# EAGLE design pwrfet (EAGLE 4.13)

## Sheet 1 of 2
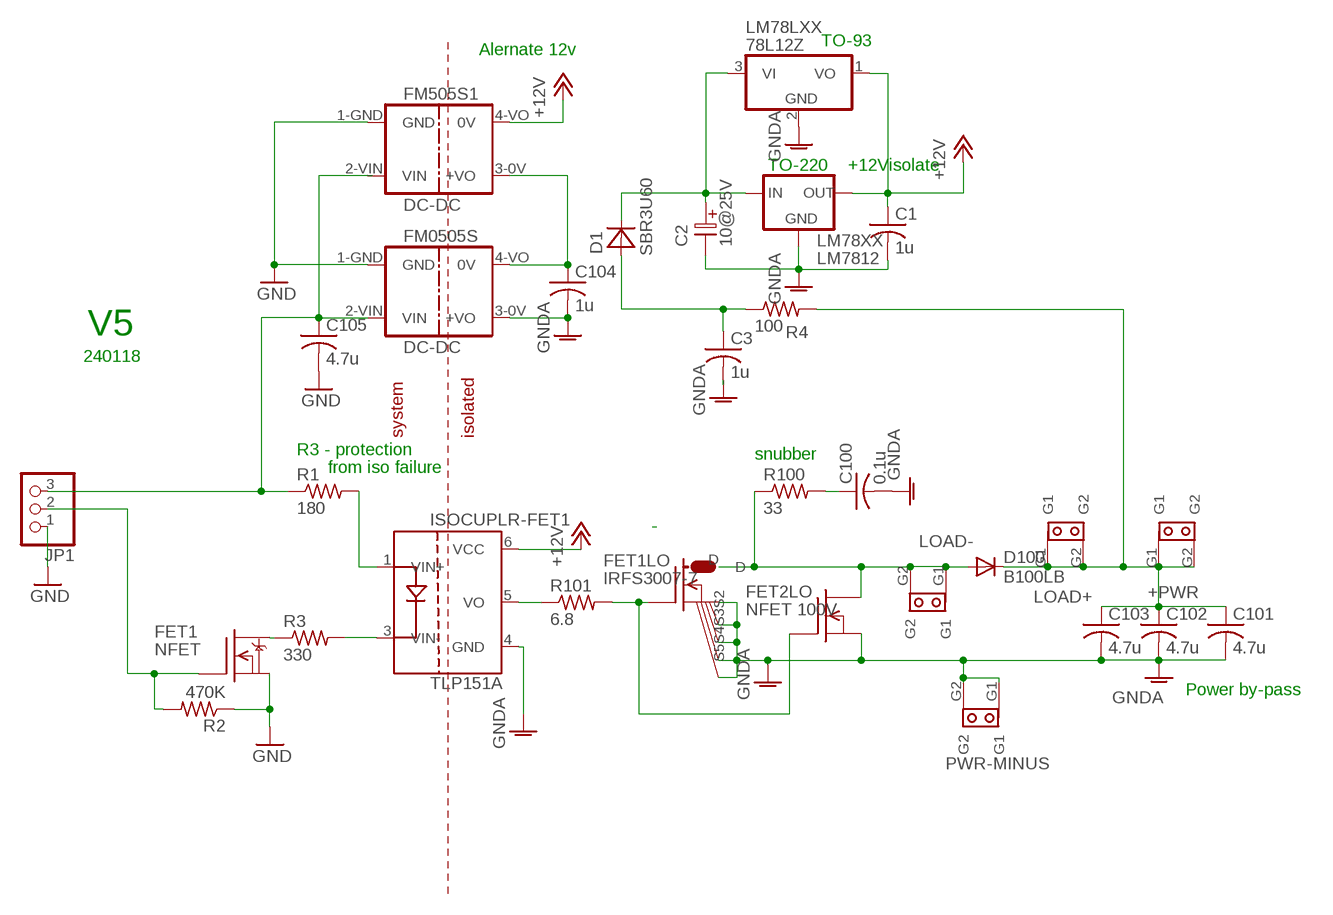
[diagram p0: schematic, sheet 1]

### Parts
+PWR  SPADE-TAB  [SPADE_TAB]
C1  1u  C-USC0603  [C0603]
C2  10@25V  ELC-2,5L  [ES-2,5L]
C3  1u  C-USC0603  [C0603]
C100  0.1u  C-USC0603  [C0603]
C101  4.7u  C-USC0805  [C0805]
C102  4.7u  C-USC0805  [C0805]
C103  4.7u  C-USC0805  [C0805]
C104  1u  C-USC0603  [C0603]
C105  4.7u  C-USC0805  [C0805]
D1  SBR3U60  [POWERDI123]
D100  B100LB  [SMB_1]
FET1  NFET  DMN3404L  [SOT-23]
FET1LO  IRFS3007-7  [D2PAK-7]
FET2LO  NFET 100V  RFP30N06  [TO220V]
FM0505S  DC-DC  [DC-DC]
FM505S1  DC-DC  [DC-DC]
ISOCUPLR-FET1  TLP151A  [SOT23-5X]
JP1  PINHD-1X3  [1X03]
LM78LXX  78L12Z  [TO92]
LM78XX  LM7812  78XXS  [78XXS]
LOAD+  SPADE-TAB  [SPADE_TAB]
LOAD-  SPADE-TAB  [SPADE_TAB]
PWR-MINUS  SPADE-TAB  [SPADE_TAB]
R1  180  R-US_R0603  [R0603]
R2  470K  R-US_R0603  [R0603]
R3  330  R-US_R0603  [R0603]
R4  100  R-US_R0603  [R0603]
R100  33  R-US_R0603  [R0603]
R101  6.8  R-US_R0603  [R0603]

### Nets
+5V: C105.1 FM505S1.2-VIN(VIN) FM0505S.2-VIN(VIN) JP1.3 R1.1
+12V: C1.1 FM505S1.4-VO(0V) ISOCUPLR-FET1.6(VCC) LM78LXX.1(VO) LM78XX.OUT
+PWR: +PWR.G1 +PWR.G2 C101.1 C102.1 C103.1 D100.C LOAD+.G1 LOAD+.G2 R4.2
DRAINFET1: D100.A FET1LO.D FET2LO.2(D) LOAD-.G1 LOAD-.G2 R100.1
GATE-FET1: FET1LO.G FET2LO.1(G) R101.2
GND: C105.2 FET1.2(S) FM505S1.1-GND(GND) FM0505S.1-GND(GND) JP1.1 R2.1
GNDA: C1.2 C2.2 C3.2 C100.2 C101.2 C102.2 C103.2 C104.2 FET1LO.S2(S1) FET1LO.S3(S2) FET1LO.S5(S3) FET1LO.S6(S4) FET1LO.S7(S5) FET2LO.3(S) FM0505S.3-0V(+VO) ISOCUPLR-FET1.4(GND) LM78LXX.2(GND) LM78XX.GND PWR-MINUS.G1 PWR-MINUS.G2
ISO5V: C104.1 FM505S1.3-0V(+VO) FM0505S.4-VO(0V)
ISO-ANODE: ISOCUPLR-FET1.1(VIN+) R1.2
ISO-CATH: ISOCUPLR-FET1.3(VIN-) R3.2
ISO-IN-DRAIN-FET1: FET1.3(D) R3.1
LO: ISOCUPLR-FET1.5(VO) R101.1
ONOFF-FET1: FET1.1(G) JP1.2 R2.2
PEAKPWR: C2.1 D1.C LM78LXX.3(VI) LM78XX.IN
PWR-RC: C3.1 D1.A R4.1
SNUB-RC: C100.1 R100.2

### Notes on the sheet
- TO-93
- Alernate 12v
- TO-220 | +12Visolate
- V5
- 240118
- system | isolated
- R3 - protection | snubber
- from iso failure
- Power by-pass

## Sheet 2 of 2

## Library data of the parts
+PWR LOAD+ LOAD- PWR-MINUS = DEH:SPADE-TAB
C1 C3 C100-C105 = rcl:C-US: CAPACITOR, American symbol
C2 = DEH:ELC-2,5L
D1 = diode-1:SBR3U60
D100 = diode-1:B100LB
FET1 = transistor-fet:DMN3404L
FET1LO = transistor-fet:IRFS3007-7
FET2LO = transistor-fet:RFP30N06
FM0505S FM505S1 = DEH:DC-DC
ISOCUPLR-FET1 = texas:TLP151A
JP1 = pinhead:PINHD-1X3: PIN HEADER
LM78LXX = linear:78*: Positive VOLTAGE REGULATOR
LM78XX = v-reg:78XXS: VOLTAGE REGULATOR
R1-R4 R100 R101 = rcl:R-US_: RESISTOR, American symbol

## Board
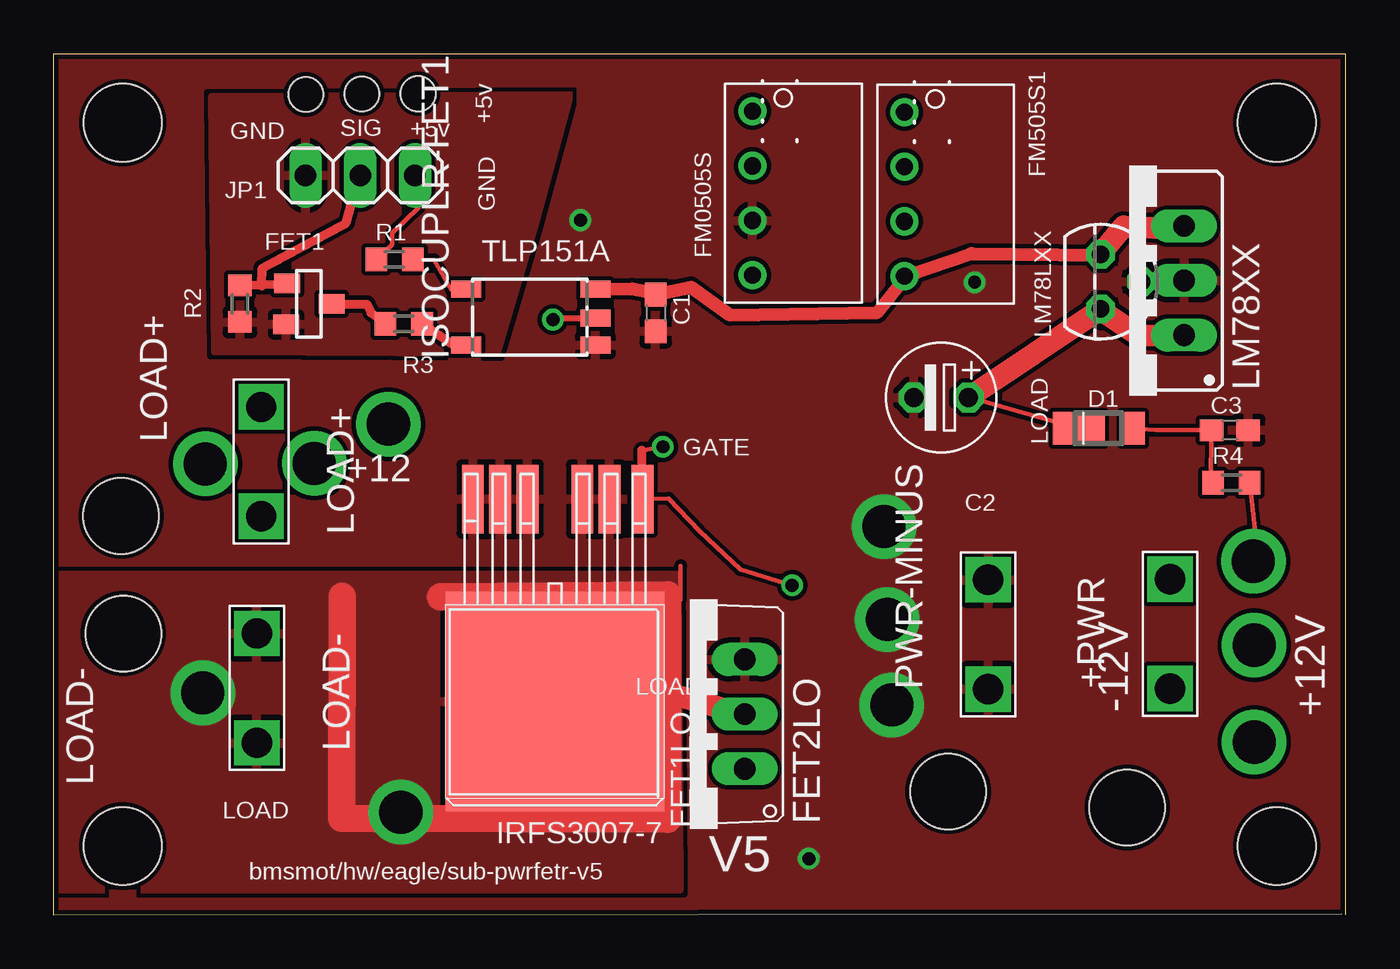
[diagram p1: board, top side]
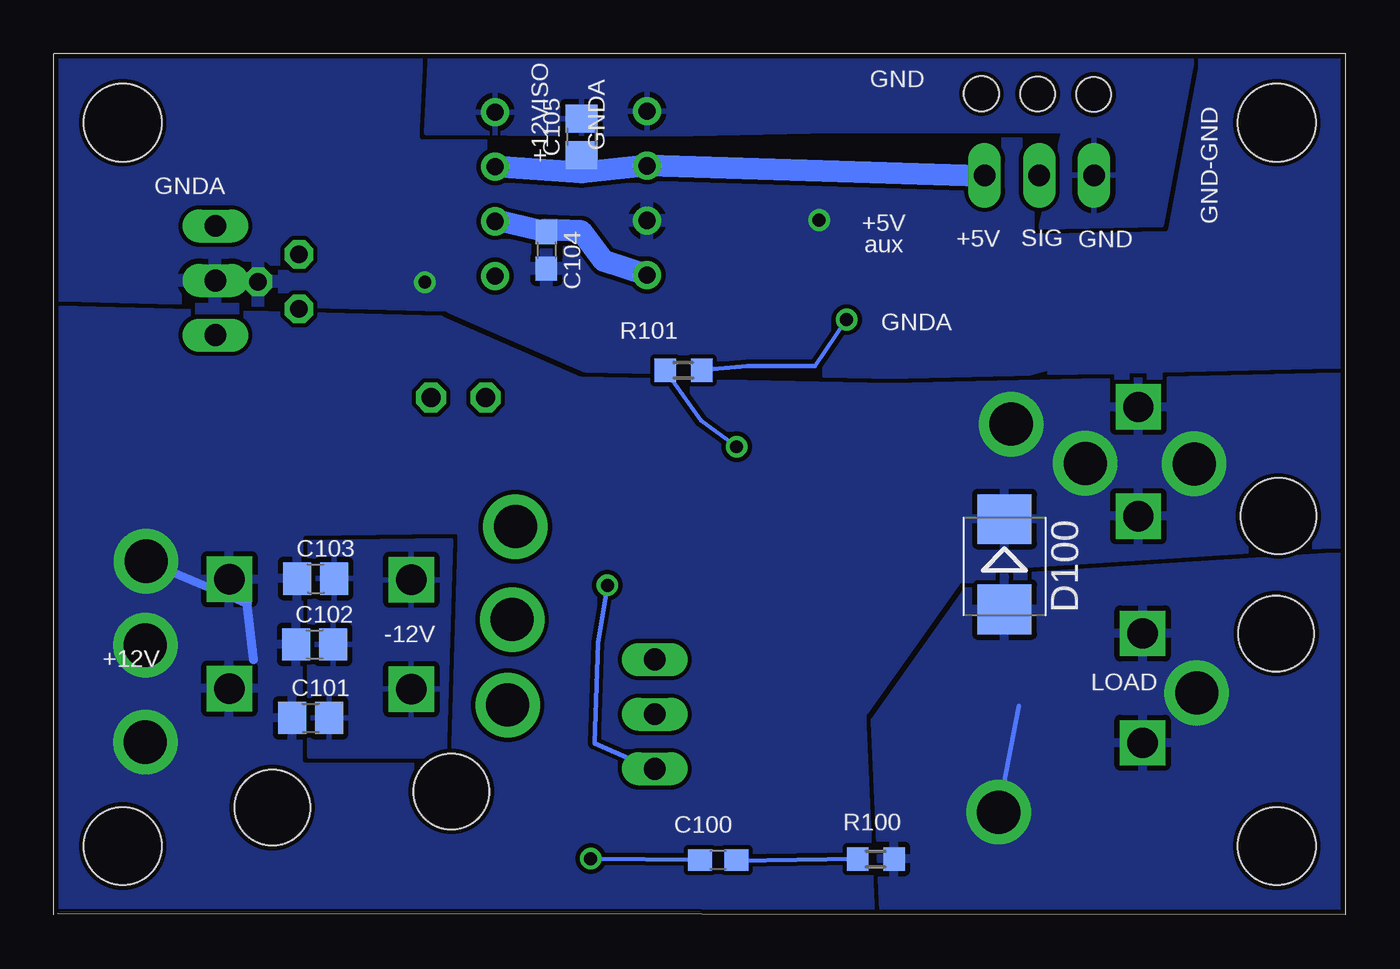
[diagram p2: board, bottom side, seen from below]

Size 60 x 40 mm. Coordinates in mm from the lower left corner, seen from the top.
Outline: 59.81,0.05 0,0 0,40 60,40 60,0
Copper layers (1*16): Top 0.035mm / dielectric 1.5mm / Bottom 0.035mm
Design rules "default": minimum track width 0.2mm, minimum drill 0.6mm, track to track 0.2mm, track to pad 0.2mm, pad to pad 0.2mm, via to via 8mil, smd to smd 0.2mm, copper to edge 9mil, drill to drill 8mil, minimum pad ring 10mil, minimum via ring 8mil, stop-mask expansion 4mil, vias tented up to drill 0mil, thermal gap 10mil
Holes 3.6 mm at 3.2,3.2 3.2,36.8 56.8,36.8 56.8,3.2
Holes 3.5 mm at 49.86,4.98 3.12,18.53 3.23,13.07 41.54,5.74
Holes 1.6 mm at 11.71,38.11 14.31,38.14 16.92,38.15

### Footprints (pad centres in the part's own frame; a part is rotated, then mirrored left to right if it is on the bottom)
SPADE_TAB = drill 1.4 square: G1 -2.54,0; G2 2.54,0
C0603 = smd 1.1 x 1: 1 -0.85,0; 2 0.85,0
ES-2,5L = drill 0.889 pad 1.27 octagon: 1 0,0; 2 2.54,0
C0805 = smd 1.3 x 1.5: 1 -0.85,0; 2 0.85,0
POWERDI123 = smd 1.1 x 1.5: A 1,0 | smd 2.4 x 1.5: C -1.5,0
SMB_1 = smd 2.3 x 2.5: A 1.9,0; C -2.3,0
SOT-23 = smd 0.9 x 1.2: 1 -1,-1.006; 2 0.9,-1.056; 3 -0.05,1.056
D2PAK-7 = smd 10.16 x 10.16: D 0,4.572 | smd 1.016 x 3.175: G -4.064,-4.826; S2 -2.54,-4.826; S3 -1.27,-4.826; S5 1.27,-4.826; S6 2.54,-4.826; S7 3.81,-4.826
TO220V = drill 1.016 long: 1 -2.54,-2.54; 2 0,-2.54; 3 2.54,-2.54
DC-DC = drill 0.8 round: 1-GND 0,-1.27; 2-VIN 2.54,-1.27; 3-0V 5.08,-1.27; 4-VO 7.62,-1.27
SOT23-5X = smd 0.8 x 1.4: 1 1.35,2.97; 3 -1.25,2.97; 4 -1.25,-3.03; 5 0,-3.03; 6 1.35,-3.03
1X03 = drill 1 long: 1 -2.54,0; 2 0,0; 3 2.54,0
TO92 = drill 0.813 octagon: 1 -1.27,0; 2 0,1.905; 3 1.27,0
78XXS = drill 1.016 long: GND 0,-2.54; IN -2.54,-2.54; OUT 2.54,-2.54
R0603 = smd 1 x 1.1: 1 -0.85,0; 2 0.85,0

### Placement (x,y rotation side)
+PWR  51.85,13.05 90 top
C1  27.96,27.96 270 top
C2  42.48,24.03 180 top
C3  54.62,22.52 0 top
C100  29.14,2.56 180 bottom
C101  48.07,9.15 0 bottom
C102  47.89,12.56 0 bottom
C103  47.84,15.62 0 bottom
C104  37.12,30.87 270 bottom
C105  35.49,36.14 90 bottom
D1  49.11,22.6 0 top
D100  15.85,16.09 270 bottom
FET1  11.84,28.33 270 top
FET1LO  23.27,14.49 180 top
FET2LO  29.55,9.33 90 top
FM0505S  33.72,37.34 270 top
FM505S1  40.78,37.29 270 top
ISOCUPLR-FET1  22.12,27.72 90 top
JP1  14.23,34.35 0 top
LM78LXX  48.61,29.41 270 top
LM78XX  49.96,29.47 90 top
LOAD+  9.63,21.06 270 top
LOAD-  9.43,10.54 270 top
PWR-MINUS  43.4,13.03 90 top
R1  15.82,30.45 0 top
R2  8.64,28.39 90 top
R3  16.25,27.46 0 top
R4  54.69,20.07 0 top
R100  21.82,2.6 180 bottom
R101  30.76,25.3 180 bottom

### Tracks (layer width: path | path; a pad name or v marks a point on that pad's centre or on a via)
+5V
  Top 0.203: R1.1 15.71,31.13 15.71,31.67 16.94,32.85 16.98,33.97 JP1.3
  Bottom 1.016: JP1.3 16.91,34.33 FM0505S.2-VIN 35.49,34.48 | C105.1 35.52,35.41 35.49,34.48 | FM505S1.2-VIN 39.52,34.77 35.49,34.48
+12V
  Top 0.61: ISOCUPLR-FET1.6 26.86,29.09 27.94,28.89 C1.1 29.6,29.16 31.4,27.87 38.24,27.99 39.61,29.71 | 39.61,29.71 FM505S1.4-VO | 39.61,29.71 42.62,30.72 48.68,30.64 LM78LXX.1
  Top 1.016: FM505S1.4-VO 39.49,29.68 | 48.64,30.73 LM78LXX.1 49.67,31.98 52.4,31.89 LM78XX.OUT
+PWR  (via drill 2)
  Top 0.203: v55.72,16.43 55.94,16.52 R4.2
  Bottom 0.406: v55.72,16.43 51.01,14.45 50.73,11.86
  other vias: 7.04,20.95 55.75,12.53 15.54,22.8 55.75,8.03 12.09,20.98
  pour Bottom (rank 3): -1.34,-1.99 -0.03,17.59 -0.81,17.42 -0.62,25 21.13,24.51 35.58,24.8 42.06,27.64 62.46,28.16 62.14,-2.04
DRAINFET1  (via drill 2)
  Top 0.202: 29.11,16.21 29.1,14.66 28.5,14.85
  Top 1.016: 28.5,10.39 28.27,10.39 FET2LO.2
  Top 1.27: 17.96,14.77 28.5,14.87 28.5,14.85 28.5,10.39 28.51,4.45 13.37,4.48 13.39,14.78
  Bottom 0.203: v16.12,4.77 15.18,9.71
  other vias: 6.92,10.32
  pour Top (rank 2): 28.95,15.79 29.05,1.19 -1.51,1.16 -1.7,15.79 4.24,15.79
  pour Bottom (rank 2): 21.87,9 21.43,-0.9 -3.55,-1.57 -3.31,4.74 -0.2,16.66 17.2,15.55
GATE-FET1  (via drill 0.6)
  Top 0.203: 27.32,21.57 v28.29,21.75 | FET1LO.G 28.56,19.35 29.98,17.83 31.89,16.05 v34.29,15.31
  Top 0.254: FET2LO.1 32.19,6.67
  Top 0.406: FET1LO.G 27.32,21.57
  Bottom 0.202: v28.29,21.75 29.94,22.95 R101.2
  Bottom 0.203: v34.29,15.31 34.73,12.63 34.89,7.98 32.23,6.8 FET2LO.1 32.3,6.66
  Bottom 0.254: 32.3,6.66 32.26,6.46 32.16,6.7
GND
  Bottom 1.016: JP1.1 11.66,34.31
  pour Top (rank 2): 23.93,38.09 22.32,32.15 20.54,26.12 20.1,26.12 7.51,26.18 7.37,37.99
  pour Bottom (rank 2): 13.1,36.41 23.78,36.44 31.42,36.28 42.68,36.33 42.5,40.07 7.14,39.67 8.56,32.06 14.16,31.96
GNDA  (via drill 0.6, 2)
  Top 0.203: v35.06,2.62 35.5,2.71
  Bottom 0.203: C100.2 v35.06,2.62
  other vias: 38.56,18.04 38.92,9.75 38.71,13.72 24.46,32.27 42.77,29.39
  pour Top (rank 3): -1.97,41.09 19.27,41.02 61.99,40.99 62.24,-2 -1.37,-2.17 -1.44,16.74
  pour Bottom (rank 5): -1.94,16.37 13.51,16.45 13.56,25.66 21.13,23.57 42.71,24.43 64.46,28.29 64.36,41.41 -3.7,41.54
  pour Bottom: 41.54,17.41 41.85,7.34 48.13,7.36 48.13,17.32
ISO5V
  Bottom 1.016: FM0505S.4-VO 34.45,30.37 35.5,31.76 37.21,31.83 C104.1 39.49,32.27 FM505S1.3-0V
ISO-ANODE
  Top 0.203: ISOCUPLR-FET1.1 18.46,29.04 17.67,30.42 R1.2
ISO-CATH
  Top 0.406: ISOCUPLR-FET1.3 18.45,26.54 R3.2
ISO-IN-DRAIN-FET1
  Top 0.406: FET1.3 14.54,28.37 14.73,27.97 R3.1
LO  (via drill 0.6)
  Top 0.305: v23.18,27.65 23.18,27.7 ISOCUPLR-FET1.5
  Bottom 0.203: R101.1 27.81,25.49 24.64,25.5 v23.18,27.65
ONOFF-FET1
  Top 0.406: FET1.1 10.88,29.33 9.66,29.29 | R2.2 9.66,29.29 | 9.66,29.29 9.66,29.22 9.68,30.04 13.57,32.13 14.15,34.22 JP1.2
PEAKPWR
  Top 0.203: C2.1 42.54,24.04 D1.C
  Top 1.016: LM78XX.IN 50.4,26.91 48.53,28.16 LM78LXX.3 42.5,24.05 C2.1
PWR-RC
  Top 0.203: D1.A 51.19,22.52 53.72,22.51 C3.1 53.74,19.96 R4.1
SNUB-RC
  Bottom 0.203: C100.1 28.3,2.52 R100.2

### Text on the board
tPlace: GND | +5v | +5v | SIG | GND
bPlace: GNDA
tNames: TLP151A | LOAD+ | LOAD | GATE | +12 | -12V | +12V | LOAD | LOAD- | LOAD | IRFS3007-7 | bmsmot/hw/eagle/sub-pwrfetr-v5 | V5
bNames: +12VISO | GNDA | GND-GND | GND | +5V | GND | SIG | +5V | aux | GNDA | -12V | +12V | LOAD